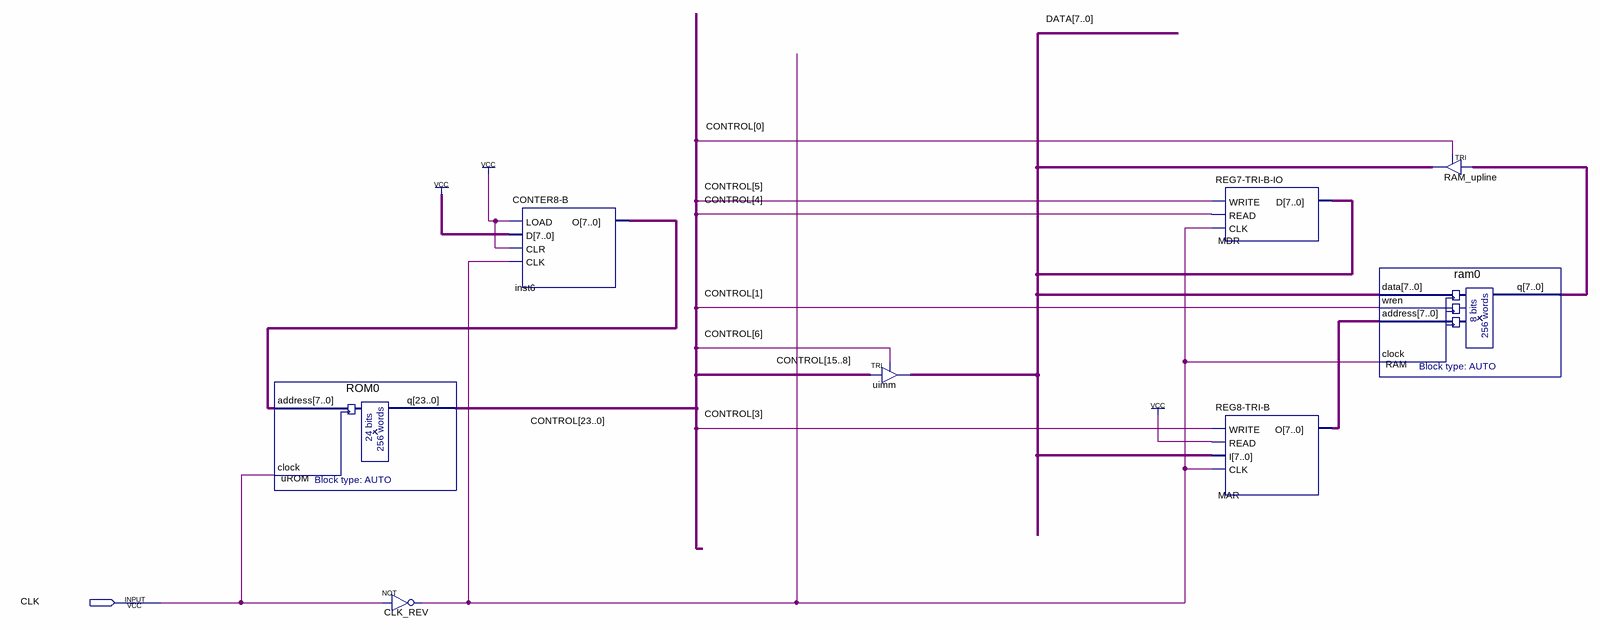
[diagram p0: schematic sheet]
// Quartus schematic EXP2.bdf as structural Verilog: 8 symbols, 1 pins
module EXP2 (
  input  CLK
);

  wire CLK_REV_out;
  wire [7:0] DATA, inst6_o, MAR_o, RAM_q;
  wire [23:0] CONTROL;

  ROM0 uROM (.address(inst6_o), .clock(CLK), .q(CONTROL));
  not CLK_REV (CLK_REV_out, CLK);
  \CONTER8-B  inst6 (.LOAD(1'b1), .D({8{1'b1}}), .CLR(1'b1), .CLK(CLK_REV_out), .O(inst6_o));
  TRI uimm[7:0] (.IN(CONTROL[15:8]), .OE(CONTROL[6]), .OUT(DATA));
  \REG7-TRI-B-IO  MDR (.WRITE(CONTROL[5]), .READ(CONTROL[4]), .CLK(CLK_REV_out), .D(DATA));
  \REG8-TRI-B  MAR (.WRITE(CONTROL[3]), .READ(1'b1), .I(DATA), .CLK(CLK_REV_out), .O(MAR_o));
  ram0 RAM (.data(DATA), .wren(CONTROL[1]), .address(MAR_o), .clock(CLK_REV_out), .q(RAM_q));
  TRI RAM_upline[7:0] (.IN(RAM_q), .OE(CONTROL[0]), .OUT(DATA));
endmodule
